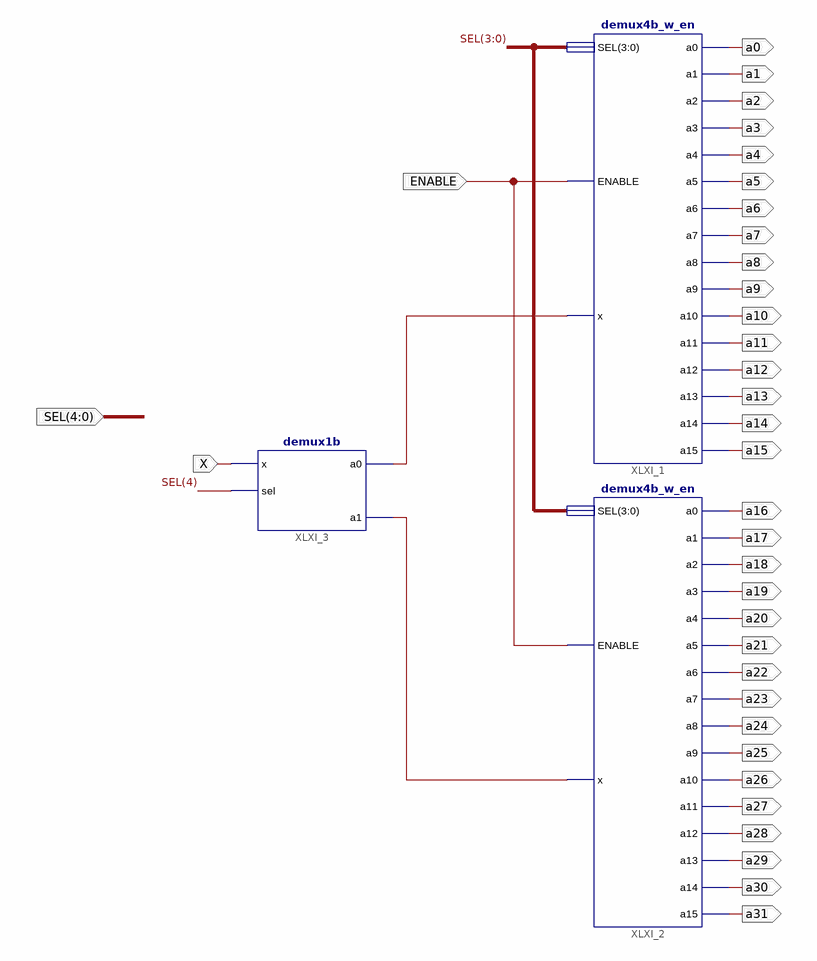
[diagram p0: schematic sheet 1]
// Xilinx ISE schematic demux5b_w_en.sch (artix7) as structural Verilog: 3 symbols, 35 ports
module demux5b_w_en (
  input  ENABLE,
  input  X,
  input  [4:0] SEL,
  output a0,
  output a1,
  output a2,
  output a3,
  output a4,
  output a5,
  output a6,
  output a7,
  output a8,
  output a9,
  output a10,
  output a11,
  output a12,
  output a13,
  output a14,
  output a15,
  output a16,
  output a17,
  output a18,
  output a19,
  output a20,
  output a21,
  output a22,
  output a23,
  output a24,
  output a25,
  output a26,
  output a27,
  output a28,
  output a29,
  output a30,
  output a31
);

  wire XLXN_1, XLXN_2;

  demux4b_w_en XLXI_1 (
    .ENABLE(ENABLE), .x(XLXN_1), .SEL(SEL[3:0]), .a0(a0), .a1(a1), .a2(a2), .a3(a3), .a4(a4), .a5(a5),
    .a6(a6), .a7(a7), .a8(a8), .a9(a9), .a10(a10), .a11(a11), .a12(a12), .a13(a13), .a14(a14), .a15(a15));
  demux4b_w_en XLXI_2 (
    .ENABLE(ENABLE), .x(XLXN_2), .SEL(SEL[3:0]), .a0(a16), .a1(a17), .a2(a18), .a3(a19), .a4(a20), .a5(a21),
    .a6(a22), .a7(a23), .a8(a24), .a9(a25), .a10(a26), .a11(a27), .a12(a28), .a13(a29), .a14(a30), .a15(a31));
  demux1b XLXI_3 (.x(X), .sel(SEL[4]), .a0(XLXN_1), .a1(XLXN_2));
endmodule
